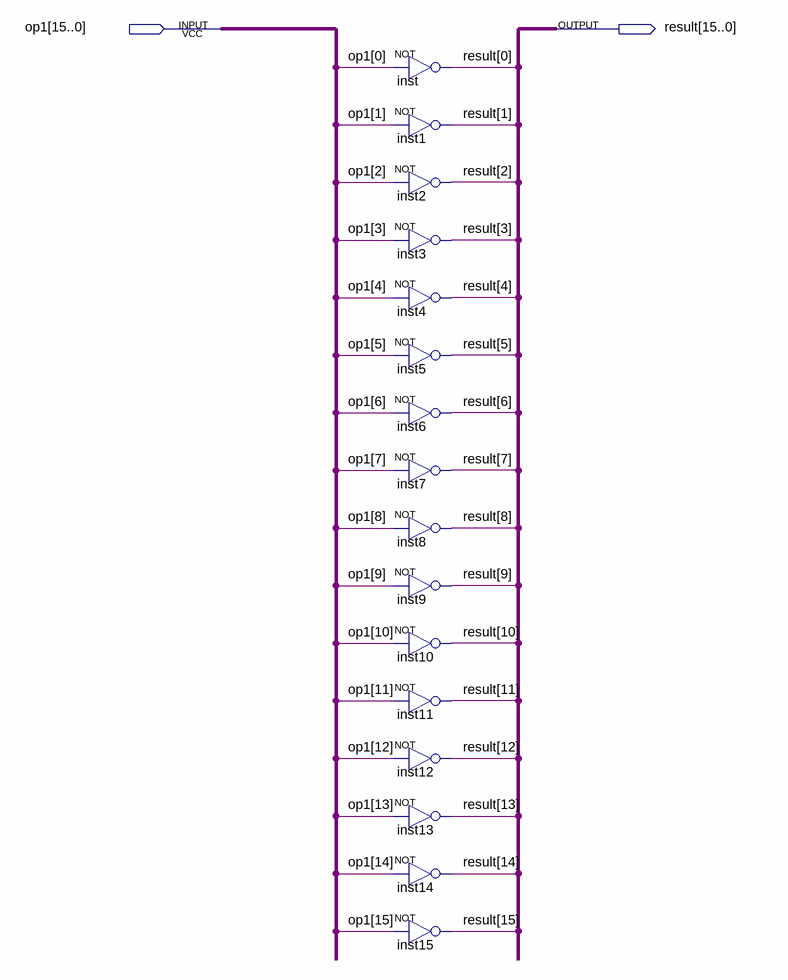
[diagram p0: schematic sheet]
// Quartus schematic 16not.bdf as structural Verilog: 16 symbols, 2 pins
module \16not  (
  input  [15:0] op1,
  output [15:0] result
);

  not inst (result[0], op1[0]);
  not inst1 (result[1], op1[1]);
  not inst2 (result[2], op1[2]);
  not inst3 (result[3], op1[3]);
  not inst4 (result[4], op1[4]);
  not inst5 (result[5], op1[5]);
  not inst6 (result[6], op1[6]);
  not inst7 (result[7], op1[7]);
  not inst8 (result[8], op1[8]);
  not inst9 (result[9], op1[9]);
  not inst10 (result[10], op1[10]);
  not inst11 (result[11], op1[11]);
  not inst12 (result[12], op1[12]);
  not inst13 (result[13], op1[13]);
  not inst14 (result[14], op1[14]);
  not inst15 (result[15], op1[15]);
endmodule
